# Altium schematic sheet WlPK1_main.SchDoc
size A4; LotOfPieces: 1
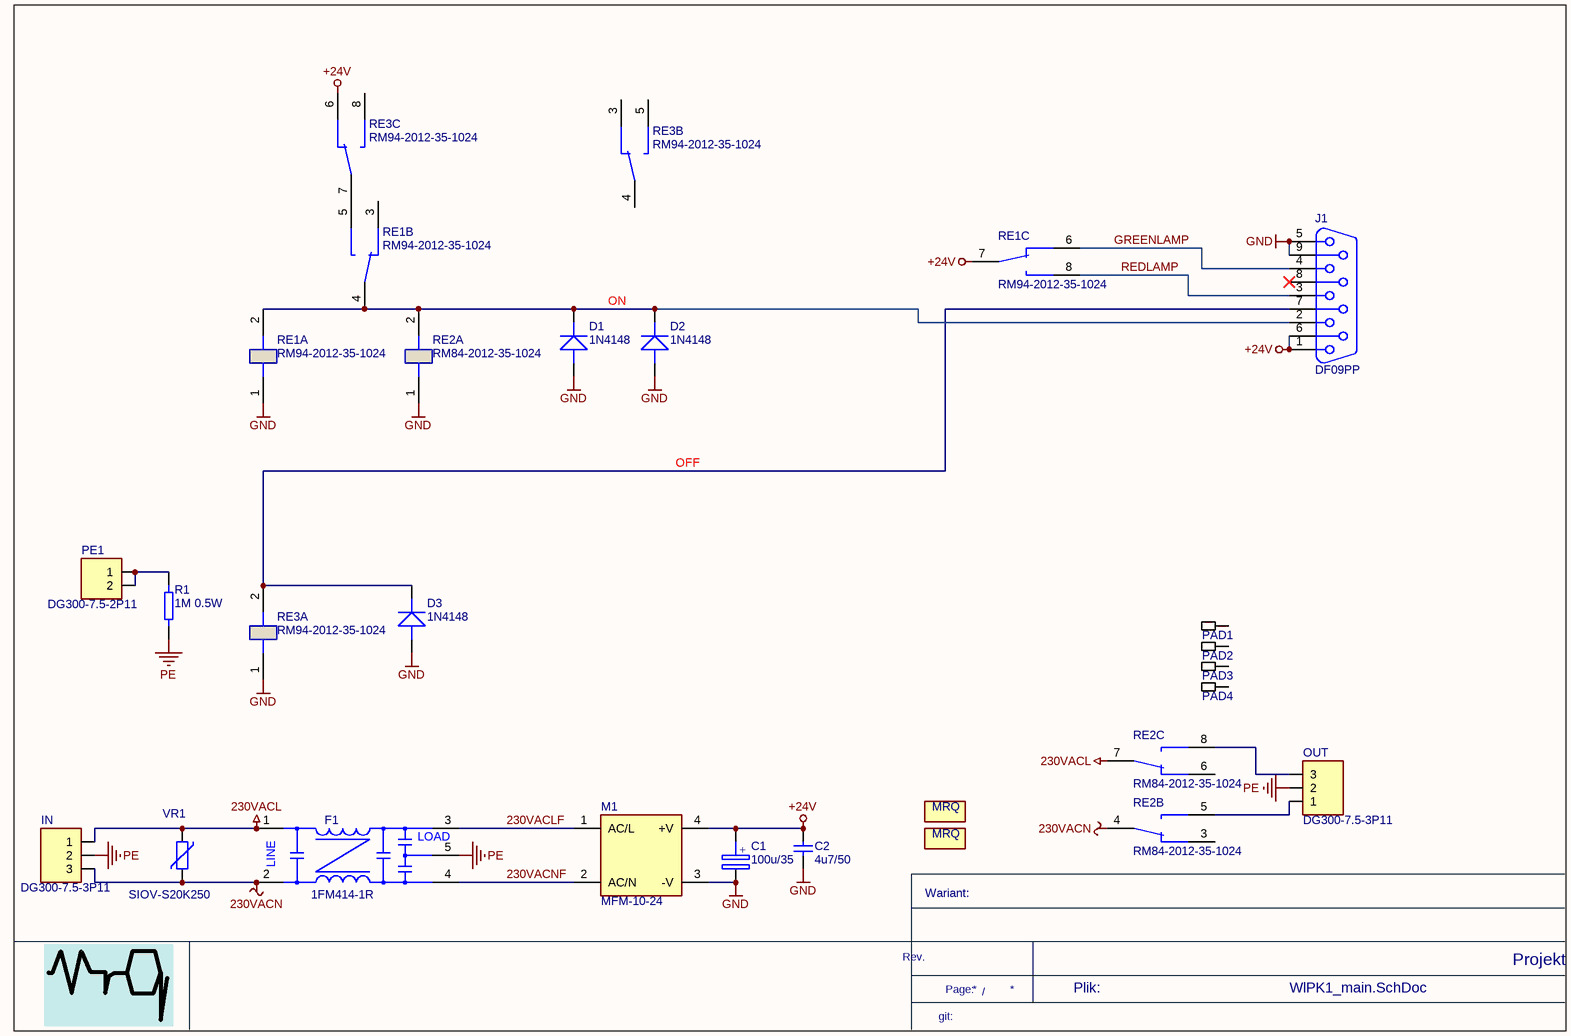
[diagram p0: WlPK1_main.SchDoc]

## Parts
C1  100u/35  [CE1028]
C2  4u7/50  [1210]
D1  1N4148  [CE02]
D2  1N4148  [CE02]
D3  1N4148  [CE02]
F1  1FM414-1R  [1FM414]
IN  DG300-7.5-3P11  [DG300-7.5-3P11]
J1  DF09PP  [DB9/F]
LOGO1  MRQ_5  [MRQ_5_TL]  (value not drawn)  (no BOM)
LOGO2  MRQ_5  [MRQ_5_TL]  (value not drawn)  (no BOM)
M1  MFM-10-24  [MFM-10-24]
OUT  DG300-7.5-3P11  [DG300-7.5-3P11]
PAD1  PAD3_5MM  [PAD3_5MM]  (value not drawn)  (no BOM)
PAD2  PAD3_5MM  [PAD3_5MM]  (value not drawn)  (no BOM)
PAD3  PAD3_5MM  [PAD3_5MM]  (value not drawn)  (no BOM)
PAD4  PAD3_5MM  [PAD3_5MM]  (value not drawn)  (no BOM)
PE1  DG300-7.5-2P11  [DG300-7.5-2P11]
R1  1M 0.5W  [R502816]
RE1  RM94-2012-35-1024  [RM84-P]  (parts A,B,C of 3)
RE2  RM84-2012-35-1024  [RM84-P]  (parts A,B,C of 3)
RE3  RM94-2012-35-1024  [RM84-P]  (parts A,B,C of 3)
VR1  SIOV-S20K250  [SIOV-S20K275]

## Nets
230VACL: F1.1(IN1) IN.1 RE2.7 VR1.1
230VACN: F1.2(IN2) IN.3 RE2.4 VR1.2
+24V: C1.2 C2.1 J1.1 J1.6 M1.4(+V) RE1.7 RE3.6
GND: C1.1 C2.2 D1.ANOD D2.ANOD D3.ANOD J1.5 J1.9 M1.3(-V) RE1.1(A1) RE2.1(A1) RE3.1(A1)
PE: F1.5 IN.2 OUT.2 R1.1
230VACLF: F1.3(OUT2) M1.1(AC/L)
230VACNF: F1.4(OUT1) M1.2(AC/N)
GREENLAMP: J1.4 RE1.6
OFF: D3.CATH J1.7 RE3.2(A2)
ON: D1.CATH D2.CATH J1.2 RE1.2(A2) RE1.4 RE2.2(A2)
REDLAMP: J1.3 RE1.8
NetOUT_1: OUT.1 RE2.5
NetOUT_3: OUT.3 RE2.8
NetPE1_1: PE1.1 PE1.2 R1.2
NetRE1_5: RE1.5 RE3.7

Not connected (* = marked no-connect by the designer): J1 8*; PAD1 1; PAD2 1; PAD3 1; PAD4 1; RE1 3(22); RE2 3(22) 6(12); RE3 3(22) 4(21) 5(24) 8(14)

## Notes on the sheet
- Wariant:
- Rev.
- /
- Projekt i wykonanie: (C) Miroslaw Lach MRQ, www.mlach.com
- git:
- Page:
- Plik:
- (in symbol CAP15) +
- (in symbol Ind14) LOAD; LINE
- (in symbol Oth88) MRQ

## Library data of the parts
C1 = CAP15: PartIdx: CAP15; Descript: Kondensator: elektrolityczny; THT; 100uF; 35VDC; Ø6,3x11mm; ±20%; Reference5: SD1V107M6L011BB; Identyfikator: 15; Value: 100u/35; Supplier5: tme.pl; Manufacturer5: SAMHA; Typ5: SD1V107M6L011BB; Price5: 0,25; DateOfPrice5: 2020-11-08; ID: 15
C2 = CAP99: PartIdx: CAP99; Descript: Kondensator: ceramiczny; 4,7uF; 50V; X7R; ±10%; SMD; 1210; -55÷125°C; Reference5: CL32B475KBUYNNE; Identyfikator: 99; Value: 4u7/50; Supplier5: tme.pl; Manufacturer5: Samsung; Typ5: CL32B475KBUYNNE; Price5: 1,9; DateOfPrice5: 2020-11-08; ID: 99
D1-D3 = DIO2: PartIdx: DIO2; Descript: Dioda: przełączająca; 100V; 300mA; 2A; DO35; Reference5: 1N4148-TAP; Identyfikator: 2; Value: 1N4148; Supplier5: tme.pl; Manufacturer5: Vishay; Price5: 0,3; Typ5: 1N4148-TAP; DateOfPrice5: 2020-11-08; ID: 2
F1 = Ind14: PartIdx: Ind14; Descript: Radio filter 250VAC, 1A; Identyfikator: 14; Value: 1FM414-1R; Reference5: 1FM414-1R; Supplier5: tme.pl; Manufacturer5: FilterCon; Price5: 16,5; DateOfPrice5: 2020-11-08; ID: 14; InductCurr: -; Typ5: -
IN OUT = Con33: PartIdx: Con33; Descript: Listwa zaciskowa; kątowe 90°; 2,5mm2; 7,5mm; tory:3; cynowany; 24A; Identyfikator: 33; Typ5: DG300-7.5-03P-11-00A(H); Replacement: maritex: TB7503S; Value: DG300-7.5-3P11; Reference5: DG300-7.5-3P11; Supplier5: tme.pl; Price5: 1,5; Manufacturer5: Degson; DateOfPrice5: 2020-11-08; ID: 33
J1 = Con312: Kod: Con312; ID: 312; Descript: Gniazdo; D-Sub; PIN:9; żeńskie; proste; THT; złocony; Typ5: DS1034-09FUNSISS; Replacement: bd; Value: DF09PP; Price5: 2; DateOfPrice5: 2020-11-08; Supplier5: tme.pl; Reference5: DF09PP; Manufacturer5: Connfly
LOGO1 LOGO2 = Oth88: Kod: Oth88; ID: 88; Descript: bd; Value: MRQ_5; Price5: -1; DateOfPrice5: 2010-01-01; Supplier5: bd; Reference5: bd; Manufacturer5: bd; Typ5: bd
M1 = Mod92: PartIdx: Mod92; Identyfikator: 92; Descript: Zasilacz: impulsowy; 10W; 80÷264VAC; Wyjścia: 1; 420mA; -30÷85°C; Value: MFM-10-24; Supplier5: tme.pl; Reference5: MFM-10-24; Manufacturer5: MeanWell; Typ5: MFM-10-24; Price5: 35; DateOfPrice5: 2010-01-01; ID: 92
PAD1-PAD4 = Oth106: PartIdx: Oth106; Identyfikator: 106; Descript: bd; Value: PAD3_5MM; DateOfPrice5: 2010-01-01; ID: 106; Manufacturer5: bd; Price5: -1; Reference5: bd; Supplier5: bd; Typ5: bd
PE1 = Con32: Descript: Listwa zaciskowa; kątowe 90°; 2,5mm2; 7,5mm; tory:2; cynowany; 24A; Typ5: DG300-7.5-02P-11-00A(H); Replacement: maritex: TB7502S; ID: 32; Kod: Con32; Value: DG300-7.5-2P11; Reference5: DG300-7.5-2P11; Supplier5: tme.pl; Manufacturer5: Degson; Price5: 1; DateOfPrice5: 2020-11-08
R1 = Res69: PartIdx: Res69; Descript: Resistor 1 megaohm, 0.5W, 5%; Reference5: 1/2W-1M; Identyfikator: 69; Typ5: brak danych; Value: 1M 0.5W; Supplier5: tme.pl; Price5: 0,2; DateOfPrice5: 2020-06-25; Manufacturer5: brak danych; ID: 69
RE1 RE3 = Rel24: Descript: Przekaźnik: elektromagnetyczny; DPDT; Ucewki : 24VDC; 8A/250VAC, nie produkowany; ID: 24; Kod: Rel24; Value: RM94-2012-35-1024; Supplier5: -; Reference5: RM94-2012-35-1024; Manufacturer5: Relpol; Typ5: RM94-2012-35-1024; Price5: 5; DateOfPrice5: 2020-07-19
RE2 = Rel14: Descript: Przekaźnik: elektromagnetyczny; DPDT; Ucewki : 24VDC; 8A/250VAC; ID: 14; Kod: Rel14; Value: RM84-2012-35-1024; Supplier5: tme.pl; Reference5: RM84-2012-35-1024; Manufacturer5: Relpol; Typ5: RM84-2012-35-1024; Price5: 6,5; DateOfPrice5: 2010-01-01
VR1 = Vre35: PartIdx: Vre35; Descript: Warystor: metalowo-tlenkowy; THT; 250VAC; 320VDC; 390V; 8000A; 140J; Identyfikator: 35; Value: SIOV-S20K250; Reference5: SIOV-S20K250; Supplier5: tme.pl; Manufacturer5: Epcos; Price5: 3; Typ5: S20K250; DateOfPrice5: 2020-11-08; ID: 35